# EAGLE design NodeMCU_THT (EAGLE 9.6.2)
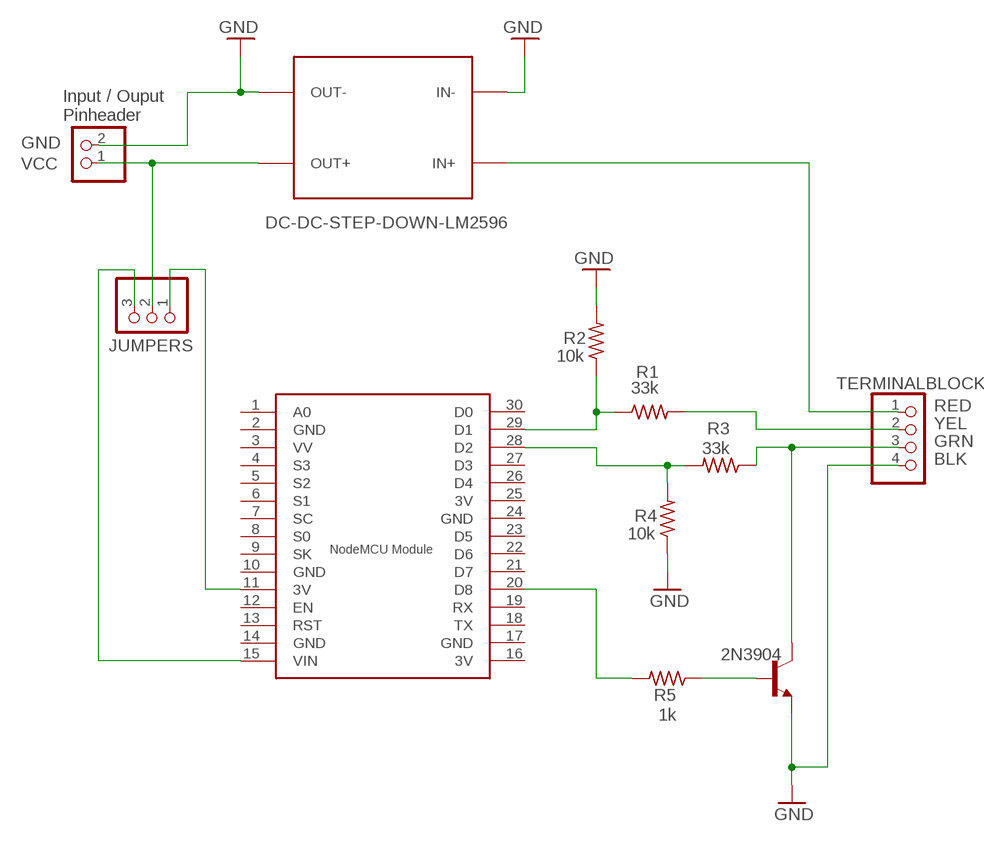
[diagram p0: schematic, sheet 1]

## Parts
JP2  PINHD-1X2  [1X02]
JUMPERS  PINHD-1X3  [1X03]
R1  33k  R-US_0204/7  [0204/7]
R2  10k  R-US_0204/7  [0204/7]
R3  33k  R-US_0204/7  [0204/7]
R4  10k  R-US_0204/7  [0204/7]
R5  1k  R-US_0204/7  [0204/7]
T1  2N3904  [TO92]
TERMINALBLOCK  PINHD-1X4  [1X04]
U$1  NODEMCU  [NODEMCU]
U$2  DC-DC-STEP-DOWN-LM2596  [DC-DC-STEP-DOWN-LM2596]

## Nets
GND: JP2.2 R2.2 R4.1 T1.3(E) TERMINALBLOCK.4 U$2.IN- U$2.OUT-
N$1: R1.1 R2.1 U$1.29(D1)
N$2: R1.2 TERMINALBLOCK.2
N$3: R3.2 R4.2 U$1.28(D2)
N$4: R3.1 T1.1(C) TERMINALBLOCK.3
N$5: TERMINALBLOCK.1 U$2.IN+
N$6: JP2.1 JUMPERS.2 U$2.OUT+
N$7: R5.1 T1.2(B)
N$8: R5.2 U$1.20(D8)
N$9: JUMPERS.3 U$1.15(VIN)
N$10: JUMPERS.1 U$1.11(3V)
Unconnected: U$1.1(A0) U$1.3(VV) U$1.4(S3) U$1.5(S2) U$1.6(S1) U$1.7(SC) U$1.8(S0) U$1.9(SK) U$1.12(EN) U$1.13(RST) U$1.18(TX) U$1.19(RX) U$1.21(D7) U$1.22(D6) U$1.23(D5) U$1.26(D4) U$1.27(D3) U$1.30(D0)

## Notes on the sheet
- Input / Ouput
  Pinheader
- GND
- VCC
- RED
- YEL
- GRN
- BLK
- NodeMCU Module

## Power pins joined to a net without a drawn wire
3V: U$1.16(3V) U$1.25(3V)
GND: U$1.2(GND) U$1.10(GND) U$1.14(GND) U$1.17(GND) U$1.24(GND)

## Library data of the parts
JP2 = pinhead:PINHD-1X2: PIN HEADER
JUMPERS = pinheadDSC1:PINHD-1X3: PIN HEADER
R1-R5 = rcl:R-US_: RESISTOR, American symbol; SPICEPREFIX: R
T1 = transistor:2N3904: NPN TRANSISTOR
TERMINALBLOCK = pinhead:PINHD-1X4: PIN HEADER
U$1 = nodemcu:NODEMCU
U$2 = diy-modules:DC-DC-STEP-DOWN-LM2596: DC/DC Step-Down Regulator based on LM2596-ADJ chip LM2596 datasheet available here: http://www.ti.com/lit/ds/symlink/lm2596.pdf Click here to find device on ebay.com <http://www.ebay.com/sch/lm2596+power+regulator>

## Board
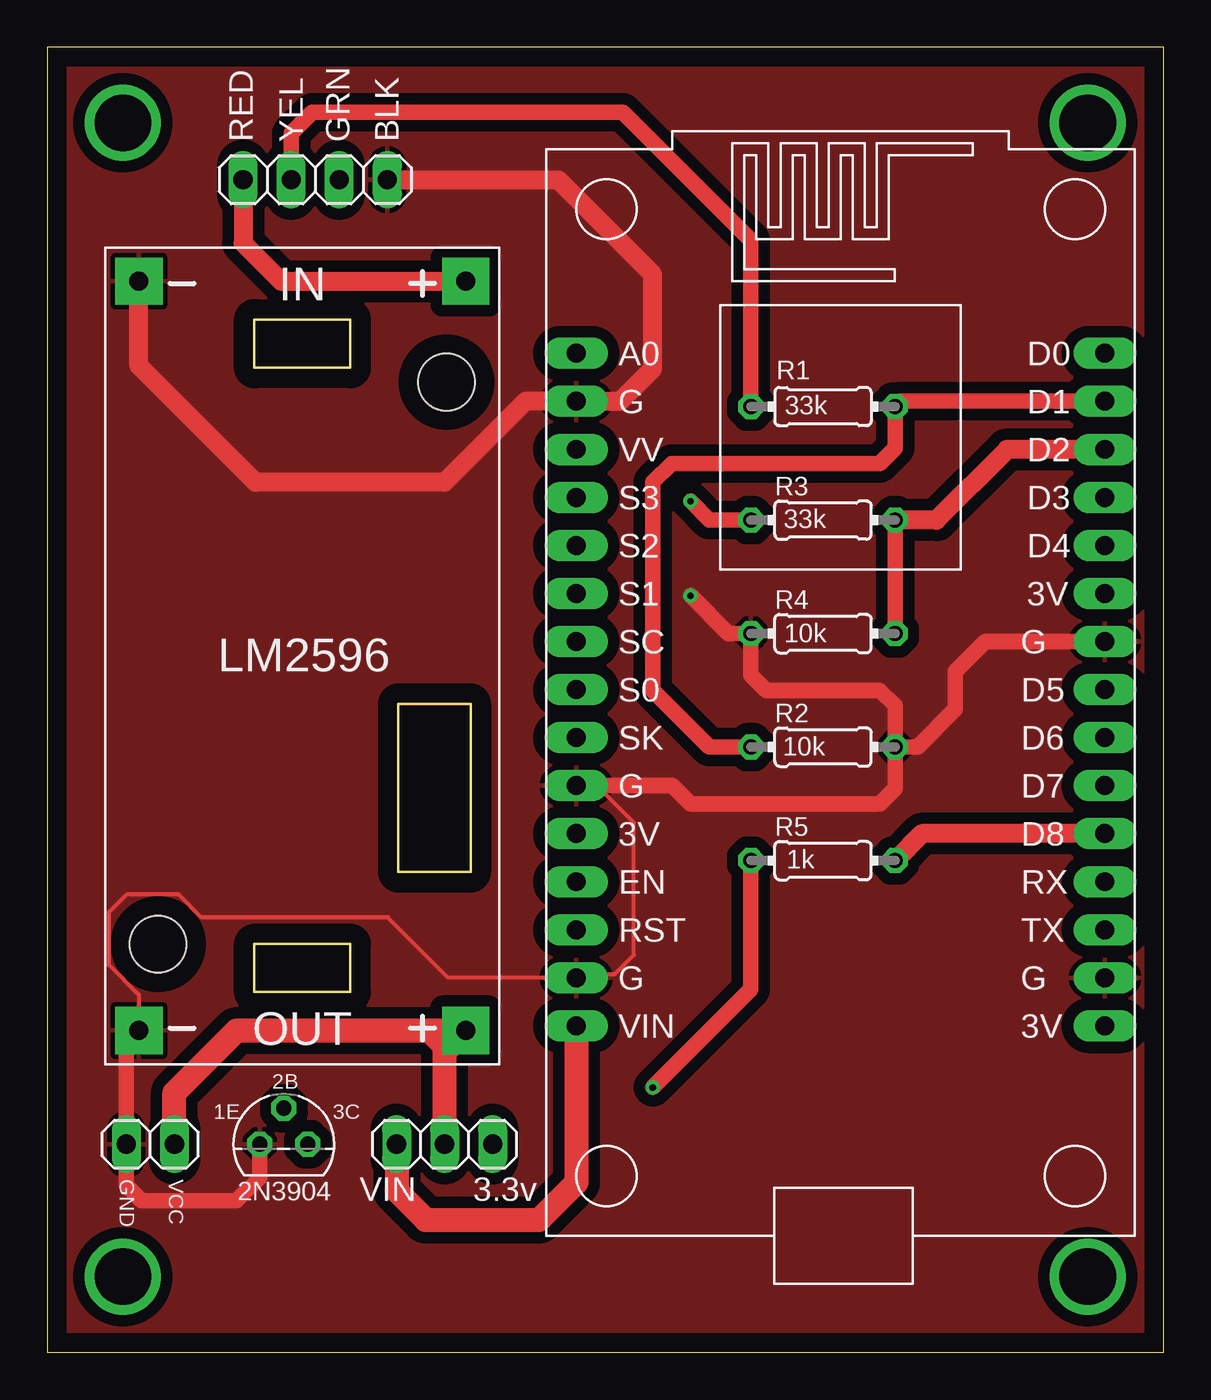
[diagram p1: board, top side]
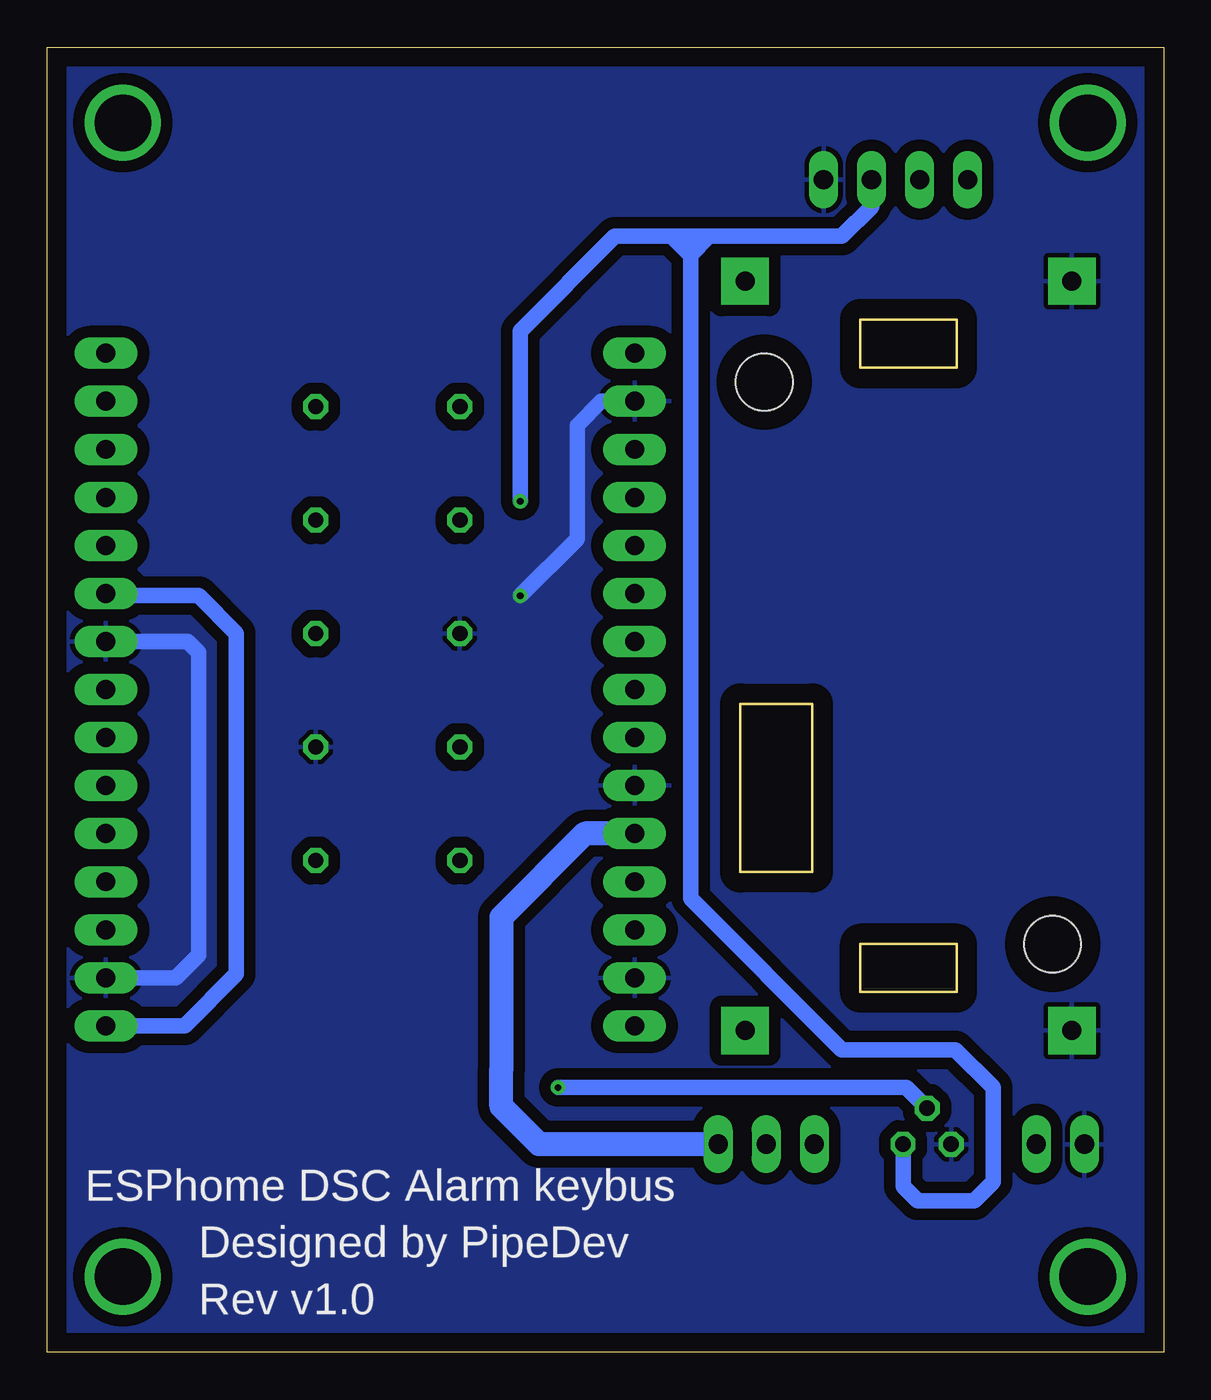
[diagram p2: board, bottom side, seen from below]

Size 59 x 69 mm. Coordinates in mm from the lower left corner, seen from the top.
Outline: 0,0 59,0 59,69 0,69 0,0
Copper layers (1*16): Top 0.035mm / dielectric 1.5mm / Bottom 0.035mm
Design rules "default": minimum track width 6mil, minimum drill 0.35mm, track to track 6mil, track to pad 6mil, pad to pad 6mil, via to via 6mil, smd to smd 6mil, copper to edge 40mil, drill to drill 6mil, minimum pad ring 10mil, minimum via ring 8mil, stop-mask expansion 4mil, vias tented up to drill 0mil, thermal gap 10mil

### Footprints (pad centres in the part's own frame; a part is rotated, then mirrored left to right if it is on the bottom)
1X02 = drill 1.016 long: 1 -1.27,0; 2 1.27,0
1X03 = drill 1.016 long: 1 -2.54,0; 2 0,0; 3 2.54,0
0204/7 = drill 0.813 octagon: 1 -3.81,0; 2 3.81,0
TO92 = drill 0.813 octagon: 1 1.27,0; 2 0,1.905; 3 -1.27,0
1X04 = drill 1.016 long: 1 -3.81,0; 2 -1.27,0; 3 1.27,0; 4 3.81,0
NODEMCU = drill 1 pad 1.676 long: 1 -13.97,17.78; 2 -13.97,15.24; 3 -13.97,12.7; 4 -13.97,10.16; 5 -13.97,7.62; 6 -13.97,5.08; 7 -13.97,2.54; 8 -13.97,0; 9 -13.97,-2.54; 10 -13.97,-5.08; 11 -13.97,-7.62; 12 -13.97,-10.16; 13 -13.97,-12.7; 14 -13.97,-15.24; 15 -13.97,-17.78; 16 13.97,-17.78; 17 13.97,-15.24; 18 13.97,-12.7; 19 13.97,-10.16; 20 13.97,-7.62; 21 13.97,-5.08; 22 13.97,-2.54; 23 13.97,0; 24 13.97,2.54; 25 13.97,5.08; 26 13.97,7.62; 27 13.97,10.16; 28 13.97,12.7; 29 13.97,15.24; 30 13.97,17.78
DC-DC-STEP-DOWN-LM2596 = drill 1 pad 2.5 square: IN+ -19.812,8.636; IN- -19.812,-8.636; OUT+ 19.812,8.636; OUT- 19.812,-8.636 | hole 3: -14.478,7.62; 15.24,-7.62

### Placement (x,y rotation side)
JP2  5.45,11 180 top
JUMPERS  21,11 180 top
R1  41,50 180 top
R2  41,32 0 top
R3  41,44 0 top
R4  41,38 0 top
R5  41,26 0 top
T1  12.5,11 0 top
TERMINALBLOCK  14.16,62 0 top
U$1  41.93,35.04 0 top
U$2  13.48,36.82 270 top

### Tracks (layer width: path | path; a pad name or v marks a point on that pad's centre or on a via)
3V
  Bottom 0.813: U$1.25 55.78,40 51,40 49,38 49,20 51.74,17.26 U$1.16
GND  (via drill 0.35)
  Top 0.2: U$2.OUT- 4.84,18.9 3.24,20.5 3.24,23.24 4.2,24.2 6.94,24.2 8.14,23 18,23 21.2,19.8 U$1.14 28.16,20 30,20 31,21 31,28 29.04,29.96 U$1.10
  Top 0.813: v34,40 36,38 R4.1 37.19,35.81 38,35 44,35 44.81,34.19 R2.2 | U$2.OUT- 4.18,16.34 JP2.2 4.18,8.82 5,8 10,8 11.23,9.23 T1.3 | U$1.24 49.58,37.58 48,36 48,34 46,32 R2.2 | R2.2 44.81,29.81 44,29 34,29 33.04,29.96 U$1.10
  Top 1: TERMINALBLOCK.4 27.01,61.99 32,57 32,52 30.28,50.28 U$1.2 25.28,50.28 21,46 11,46 4.84,52.16 U$2.IN-
  Bottom 0.813: v34,40 31,43 31,49 29.72,50.28 U$1.2 | U$1.24 51.58,37.58 51,37 51,21 52.2,19.8 U$1.17
  pour Top (isolate 0.61): 0,69 59,69 59,0 0,0
  pour Bottom (isolate 0.61): 0,69 59,69 59,0 0,0
N$1
  Top 0.813: U$1.29 45.09,50.28 R1.1 44.81,47.81 44,47 33,47 32,46 32,35 35,32 R2.1
  Top 1: U$1.29 55.62,50
N$2
  Top 0.813: TERMINALBLOCK.2 12.89,64.47 14,65.58 30.42,65.58 37.19,58.81 R1.2
N$3
  Top 0.813: R4.2 R3.2
  Top 1: U$1.28 50.74,47.74 47,44 R3.2
N$4  (via drill 0.35)
  Top 0.813: R3.1 35,44 v34,45
  Bottom 0.813: TERMINALBLOCK.3 15.43,60.57 17,59 24,59 | 26,59 29,59 34,54 v34,45 | 26,59 24,59 | 25,58 25,24 17,16 11,16 9,14 9,9 10,8 13,8 13.77,8.77 T1.1 | 24,59 25,58 | 25,58 26,59
N$5
  Top 1: TERMINALBLOCK.1 10.35,58.65 12.37,56.63 U$2.IN+
N$6
  Top 0.813: 21,15.89 20,16.89 20,17.01
  Top 1.27: JP2.1 6.72,13.72 10.01,17.01 20,17.01 U$2.OUT+ 21,15.89 JUMPERS.2
N$7  (via drill 0.35)
  Top 0.813: R5.1 37.19,19.19 v32,14
  Bottom 0.813: v32,14 13.6,14 T1.2
N$8
  Top 1: R5.2 46.23,27.42 U$1.20
N$9
  Top 1.27: U$1.15 27.96,8.96 26,7 20,7 18.46,8.54 JUMPERS.3
N$10
  Bottom 1.27: U$1.11 30.58,27.42 35,23 35,16 35,15 35,13 33,11 JUMPERS.1
N$11  (via drill 3)
  other vias: 4,65
N$12  (via drill 3)
  other vias: 55,65
N$13  (via drill 3)
  other vias: 4,4
N$14  (via drill 3)
  other vias: 55,4

### Text on the board
tNames: RED | YEL | GRN | BLK | 33k | 33k | 10k | LM2596 | 10k | 1k | 2B | 1E | 3C | GND | VCC | 2N3904 | VIN | 3.3v
bNames: ESPhome DSC Alarm keybus | Designed by PipeDev | Rev v1.0